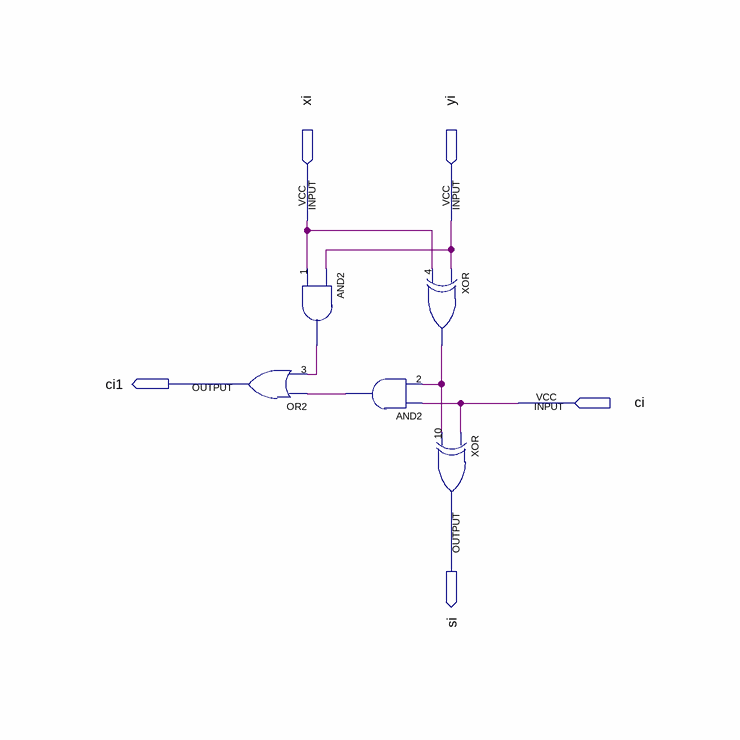
[diagram p0: schematic sheet]
// Quartus schematic fa.bdf as structural Verilog: 5 symbols, 5 pins
module fa (
  input  xi,
  input  yi,
  input  ci,
  output ci1,
  output si
);

  wire n1_out, n2_out, n4_out;

  or u_3 (ci1, n2_out, n1_out);
  and u_1 (n1_out, yi, xi);
  and u_2 (n2_out, ci, n4_out);
  xor u_4 (n4_out, yi, xi);
  xor u_10 (si, ci, n4_out);
endmodule
